# Altium project B100BA.PrjPcb (part 5 of 6)

## Sheet FOTA MicroController Block Diagram.SchDoc: FOTA MicroController Block Diagram
size 292 x 193 mm; SheetNumber: 29; SheetTotal: 50
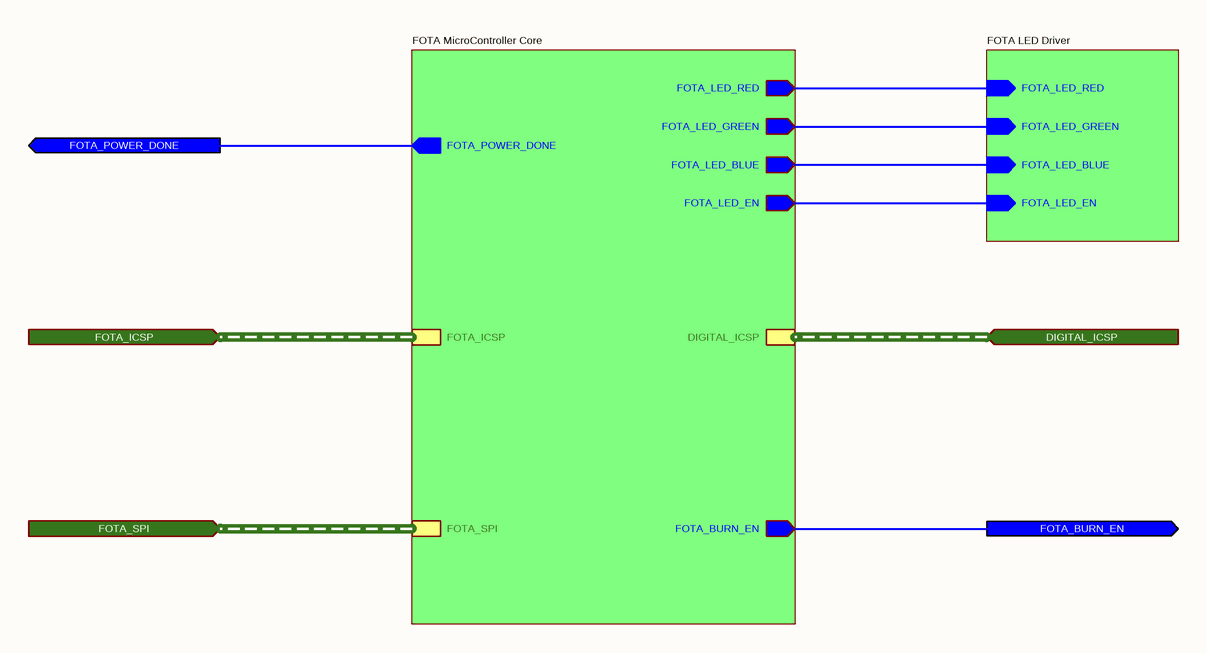
[diagram p32: FOTA MicroController Block Diagram.SchDoc]

### Sub-sheets
FOTA LED Driver = FOTA LED Driver.SchDoc: FOTA_LED_RED (in), FOTA_LED_EN (in), FOTA_LED_BLUE (in), FOTA_LED_GREEN (in)
FOTA MicroController Core = FOTA MicroController Core.SchDoc: FOTA_LED_BLUE (out), FOTA_LED_GREEN (out), FOTA_LED_EN (out), FOTA_POWER_DONE (out), FOTA_LED_RED (out), FOTA_BURN_EN (out), FOTA_SPI (harness FOTA_SPI), DIGITAL_ICSP (harness DIGITAL_ICSP), FOTA_ICSP (harness FOTA_ICSP)

### Ports
DIGITAL_ICSP (in, harness DIGITAL_ICSP), FOTA_BURN_EN (out), FOTA_ICSP (in, harness FOTA_ICSP), FOTA_POWER_DONE (out), FOTA_SPI (in, harness FOTA_SPI)

### Nets
FOTA_BURN_EN: port FOTA_BURN_EN, sheet FOTA MicroController Core/FOTA_BURN_EN
FOTA_LED_BLUE: sheet FOTA MicroController Core/FOTA_LED_BLUE, sheet FOTA LED Driver/FOTA_LED_BLUE
FOTA_LED_EN: sheet FOTA MicroController Core/FOTA_LED_EN, sheet FOTA LED Driver/FOTA_LED_EN
FOTA_LED_GREEN: sheet FOTA MicroController Core/FOTA_LED_GREEN, sheet FOTA LED Driver/FOTA_LED_GREEN
FOTA_LED_RED: sheet FOTA MicroController Core/FOTA_LED_RED, sheet FOTA LED Driver/FOTA_LED_RED
FOTA_POWER_DONE: port FOTA_POWER_DONE, sheet FOTA MicroController Core/FOTA_POWER_DONE

### Buses and harness runs
harness port DIGITAL_ICSP = sheet FOTA MicroController Core/DIGITAL_ICSP
harness port FOTA_ICSP = sheet FOTA MicroController Core/FOTA_ICSP
harness port FOTA_SPI = sheet FOTA MicroController Core/FOTA_SPI

### Notes on the sheet
- © 2021 All rights reserved.
  This document may not, in whole or in part, be copied, photocopied, reproduced, translated or converted to any electronic or machine readable from without prior written permission of Mehmet Günce Akkoyun.
  Engineer contact : akkoyun@me.com
- Property of
- Engineer :
- Date :
- Size :
- A4
- Time :
- Project :
- Page :
- /
- Customer :
- Product ID :
- Module ID :
- Version :
- File :
- Revision :

## Sheet FOTA MicroController Core.SchDoc: FOTA MicroController
size 292 x 193 mm; ApprovedBy: M. Günce Akkoyun; CheckedBy: M. Günce Akkoyun; Author: M. Günce Akkoyun; CompanyName: Ovoo Electronics; DrawnBy: M. Günce Akkoyun; Engineer: M. Günce Akkoyun; Organization: Ovoo Electronics; Address1: Necip Fazıl Mah. Ortaırmak Sok.; Address2: Birgül Apt. No: 19/6; Address3: Meram / Konya; Address4: Turkiye; DocumentNumber: 45; Revision: R01; SheetNumber: 30; SheetTotal: 42
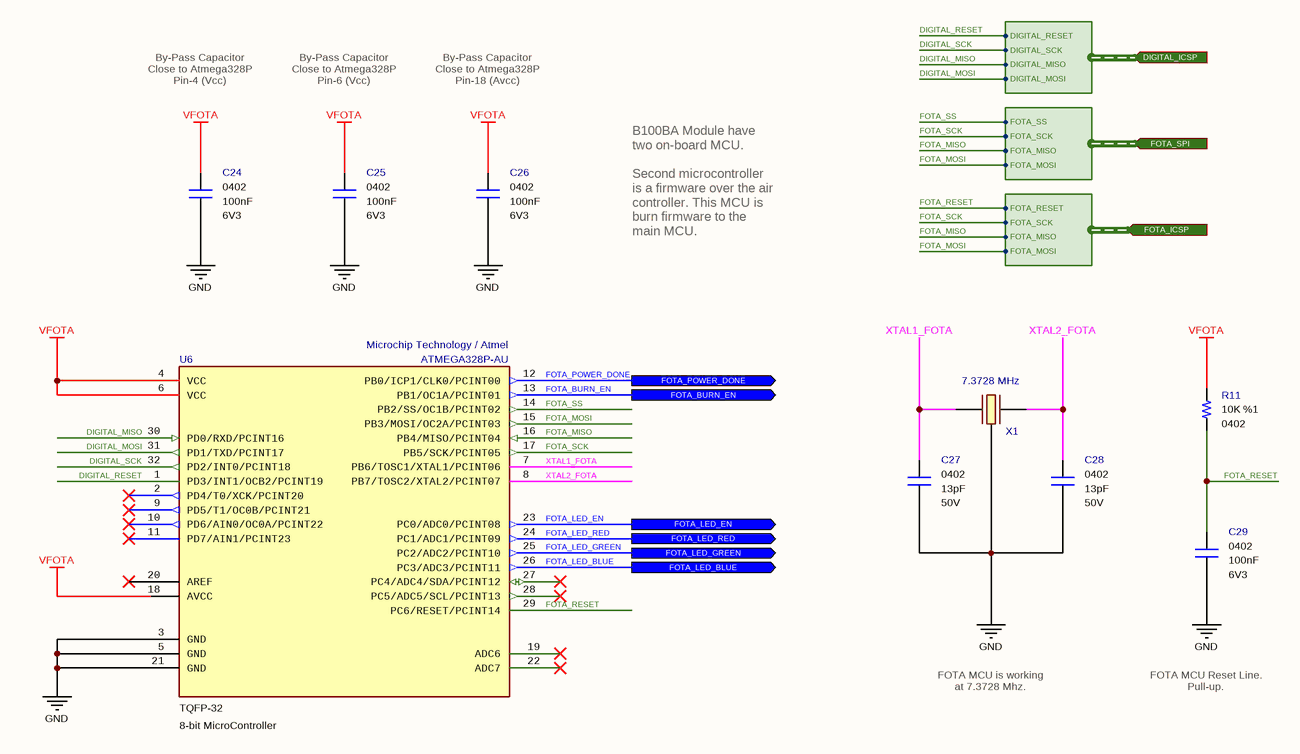
[diagram p33: FOTA MicroController Core.SchDoc]

### Parts
C24  value 100nF  Case: 0402  Voltage: 6V3  [CAPACITOR_0402]  (hidden comment: Multilayer Ceramic Capacitor)
C25  value 100nF  Case: 0402  Voltage: 6V3  [CAPACITOR_0402]  (hidden comment: Multilayer Ceramic Capacitor)
C26  value 100nF  Case: 0402  Voltage: 6V3  [CAPACITOR_0402]  (hidden comment: Multilayer Ceramic Capacitor)
C27  value 13pF  Voltage: 50V  Case: 0402  [CAPACITOR_0402]  (hidden comment: Multilayer Ceramic Capacitor)
C28  value 13pF  Voltage: 50V  Case: 0402  [CAPACITOR_0402]  (hidden comment: Multilayer Ceramic Capacitor)
C29  value 100nF  Case: 0402  Voltage: 6V3  [CAPACITOR_0402]  (hidden comment: Multilayer Ceramic Capacitor)
R11  value 10K  Tolerance: %1  Case: 0402  [RESISTOR_0402]  (hidden comment: Thick Film Resistor)
U6  8-bit MicroController  Case: TQFP-32  Manufacturer Part Number: ATMEGA328P-AU  Manufacturer Name: Microchip Technology / Atmel  [TQFP32]
X1  7.3728 MHz  [ABRACON_CRYSTAL]

### Ports
DIGITAL_ICSP (in, harness DIGITAL_ICSP), FOTA_BURN_EN (out), FOTA_ICSP (in, harness FOTA_ICSP), FOTA_LED_BLUE (out), FOTA_LED_EN (out), FOTA_LED_GREEN (out), FOTA_LED_RED (out), FOTA_POWER_DONE (out), FOTA_SPI (in, harness FOTA_SPI)

### Harnesses
FOTA_ICSP: FOTA_MOSI, FOTA_MISO, FOTA_SCK, FOTA_RESET
FOTA_SPI: FOTA_MOSI, FOTA_MISO, FOTA_SCK, FOTA_SS
DIGITAL_ICSP: DIGITAL_MOSI, DIGITAL_MISO, DIGITAL_SCK, DIGITAL_RESET

### Nets
GND: C24.1 C25.1 C26.1 C27.1 C28.1 C29.1 U6.3(GND) U6.5(GND) U6.21(GND) X1.2(GND)
VFOTA: C24.2 C25.2 C26.2 R11.2 U6.4(VCC) U6.6(VCC) U6.18(AVCC)
DIGITAL_MISO: U6.30(PD0/RXD/PCINT16) ; port DIGITAL_ICSP.DIGITAL_MISO  [project net DIGITAL_ICSP.DIGITAL_MISO]
DIGITAL_MOSI: U6.31(PD1/TXD/PCINT17) ; port DIGITAL_ICSP.DIGITAL_MOSI  [project net DIGITAL_ICSP.DIGITAL_MOSI]
DIGITAL_RESET: U6.1(PD3/INT1/OCB2/PCINT19) ; port DIGITAL_ICSP.DIGITAL_RESET  [project net DIGITAL_ICSP.DIGITAL_RESET]
DIGITAL_SCK: U6.32(PD2/INT0/PCINT18) ; port DIGITAL_ICSP.DIGITAL_SCK  [project net DIGITAL_ICSP.DIGITAL_SCK]
FOTA_BURN_EN: U6.13(PB1/OC1A/PCINT01) ; port FOTA_BURN_EN
FOTA_LED_BLUE: U6.26(PC3/ADC3/PCINT11) ; port FOTA_LED_BLUE
FOTA_LED_EN: U6.23(PC0/ADC0/PCINT08) ; port FOTA_LED_EN
FOTA_LED_GREEN: U6.25(PC2/ADC2/PCINT10) ; port FOTA_LED_GREEN
FOTA_LED_RED: U6.24(PC1/ADC1/PCINT09) ; port FOTA_LED_RED
FOTA_MISO: U6.16(PB4/MISO/PCINT04) ; port FOTA_ICSP.FOTA_MISO, port FOTA_SPI.FOTA_MISO  [project net FOTA_ICSP.FOTA_MISO]
FOTA_MOSI: U6.15(PB3/MOSI/OC2A/PCINT03) ; port FOTA_ICSP.FOTA_MOSI, port FOTA_SPI.FOTA_MOSI  [project net FOTA_ICSP.FOTA_MOSI]
FOTA_POWER_DONE: U6.12(PB0/ICP1/CLK0/PCINT00) ; port FOTA_POWER_DONE
FOTA_RESET: C29.2 R11.1 U6.29(PC6/RESET/PCINT14) ; port FOTA_ICSP.FOTA_RESET  [project net FOTA_ICSP.FOTA_RESET]
FOTA_SCK: U6.17(PB5/SCK/PCINT05) ; port FOTA_ICSP.FOTA_SCK, port FOTA_SPI.FOTA_SCK  [project net FOTA_ICSP.FOTA_SCK]
FOTA_SS: U6.14(PB2/SS/OC1B/PCINT02) ; port FOTA_SPI.FOTA_SS  [project net FOTA_SPI.FOTA_SS]
XTAL1_FOTA: C27.2 U6.7(PB6/TOSC1/XTAL1/PCINT06) X1.3(OUT/IN)
XTAL2_FOTA: C28.2 U6.8(PB7/TOSC2/XTAL2/PCINT07) X1.1(IN/OUT)

Not connected (* = marked no-connect by the designer): U6 2(PD4/T0/XCK/PCINT20)* 9(PD5/T1/OC0B/PCINT21)* 10(PD6/AIN0/OC0A/PCINT22)* 11(PD7/AIN1/PCINT23)* 19(ADC6)* 20(AREF)* 22(ADC7)* 27(PC4/ADC4/SDA/PCINT12)* 28(PC5/ADC5/SCL/PCINT13)*; X1 4(GND)

### Notes on the sheet
- By-Pass Capacitor
  Close to Atmega328P
  Pin-4 (Vcc)
- By-Pass Capacitor
  Close to Atmega328P
  Pin-6 (Vcc)
- By-Pass Capacitor
  Close to Atmega328P
  Pin-18 (Avcc)
- B100BA Module have two on-board MCU.
  Second microcontroller is a firmware over the air controller. This MCU is burn firmware to the main MCU.
- FOTA MCU is working at 7.3728 Mhz.
- FOTA MCU Reset Line. Pull-up.
- © 2021 All rights reserved.
  This document may not, in whole or in part, be copied, photocopied, reproduced, translated or converted to any electronic or machine readable from without prior written permission of Mehmet Günce Akkoyun.
  Engineer contact : akkoyun@me.com
- Property of
- Engineer :
- Date :
- Size :
- A4
- Time :
- Project :
- Page :
- /
- Customer :
- Product ID :
- Module ID :
- Version :
- File :
- Revision :

### Library data of the parts
C24-C26 C29 = Capacitor - 100nF [0402-6V3]: as C43 on sheet Master MicroController Core; Height: 0.25mm; ComponentLink1Description: Mouser; ComponentLink1URL: https://www.mouser.com.tr/ProductDetail/AVX/04026D104KAT4A?qs=sGAEpiMZZMs0AnBnWHyRQPg4iYkCw7IMED%2F4kpqgf7w%3D; ComponentLink2Description: DataSheet; ComponentLink2URL: https://www.mouser.com.tr/datasheet/2/40/cx5r-776519.pdf; ROHS: Yes; Maximum Operating Temperature: +85; Minimum Operating Temperature: -55; Supplier 1: Avnet; Supplier Part Number 1: 04026D104KAT4A; Mouser Part Number: 581-04026D104KAT4A
C27 C28 = Capacitor - 13pF [0402-50V]: Capacitor - 13pF [0402] (Ceramic); Manufacturer Name: Kemet; Manufacturer Part Number: CBR04C130F5GAC; Dielectric: C0G; Tolerance: 1%; Height: 0.55mm; ROHS: Yes; Weight: 0.65mg; ComponentLink1Description: DataSheet; ComponentLink1URL: http://www.kemet.com/Lists/ProductCatalog/Attachments/490/KEM_C1030_CBR_SMD.pdf; ComponentLink2Description: Mouser; ComponentLink2URL: http://www.mouser.com/Search/ProductDetail.aspx?qs=kSX8PZDGYstn%252bRHasf81FA%3d%3d; Supplier 1: Mouser; Supplier 2: Farnell; Supplier 3: Digi-Key; Supplier Part Number 3: 399-8812-1-ND; Supplier Part Number 2: 2773390; Supplier Part Number 1: 80-CBR04C130F5GAC; Mouser Part Number: 80-CBR04C130F5GAC
R11 = Resistor - 10K: as R21 on sheet Master MicroController Core; Height: 0.4mm; ComponentLink1Description: DataSheet; ComponentLink1URL: https://www.mouser.com.tr/datasheet/2/427/dcrcwe3-1762152.pdf; ComponentLink2Description: Mouser; ComponentLink2URL: https://www.mouser.com.tr/ProductDetail/Vishay-Dale/CRCW040210K0FKED?qs=sGAEpiMZZMu61qfTUdNhG2DpbjADlD3GcalbOv9utCY%3D; Supplier 1: Mouser; Supplier 2: Digi-Key; Supplier Part Number 1: 71-CRCW040210K0FKEDH; Supplier Part Number 2: 541-10.0KYCT-ND; Mouser Part Number: 71-CRCW0402-10K-E3
U6 = IC - ATMEGA328P: 8-bit Microcontrollers - MCU 32KB In-system Flash 20MHz 1.8V-5.5V; Supply Voltage - Min: 1.8V; Supply Voltage - Max: 5.5V; Height: 1mm; ComponentLink1Description: DataSheet; ComponentLink1URL: http://ww1.microchip.com/downloads/en/DeviceDoc/ATmega48A-PA-88A-PA-168A-PA-328-P-DS-DS40002061A.pdf; ROHS: Yes; Minimum Operating Temperature: -40; Maximum Operating Temperature: +85; ComponentLink2Description: Mouser; ComponentLink2URL: https://www.mouser.com.tr/ProductDetail/Microchip-Technology-Atmel/ATMEGA328P-AU?qs=sGAEpiMZZMtVoztFdqDXO3RbBx7FKCmV; ComponentLink3Description: ProductPage; ComponentLink3URL: https://www.microchip.com/wwwproducts/en/ATmega328p; Supplier 1: Avnet; Supplier 2: Mouser; Supplier 3: Arrow; Supplier 4: Digi-Key; Supplier Part Number 1: ATMEGA328P-AU; Supplier Part Number 2: 556-ATMEGA328P-AU; Supplier Part Number 3: ATMEGA328P-AU; Supplier Part Number 4: ATMEGA328P-AU-ND; Mouser Part Number: 556-ATMEGA328P-AU
X1 = Crystal - 7.3728 MHz (Abracon): Crystals 7.3728MHz 18pF -40C +85C; Manufacturer Part Number: ABMM2-7.3728MHZ-E2-T; ESR: 150 Ohms; Frequency Stability: 20 ppm; Height: 1.2 mm; Frequency: 7.3728 MHz; Maximum Operating Temperature: +70; Minimum Operating Temperature: -20; ROHS: Yes; Tolerance: 20 ppm; ComponentLink1Description: DataSheet; ComponentLink1URL: https://www.ecsxtal.com/store/pdf/csm-8mr.pdf; ComponentLink2Description: Mouser; ComponentLink2URL: https://www.mouser.com/Search/Refine.aspx?Keyword=520-7.3-18-20BM-JENT; Supplier 1: Mouser; Supplier 2: Arrow; Supplier Part Number 2: ABMM2-7.3728MHZ-E2-T; Supplier Part Number 1: 815-ABMM2-7.3-E2-T; Manufacturer Name: ABRACON; Mouser Part Number: 815-ABMM2-7.3-E2-T; Case: SMD

## Sheet FOTA LED Driver.SchDoc: FOTA MicroController LED Inducators
size 393 x 281 mm; ApprovedBy: M. Günce Akkoyun; CheckedBy: M. Günce Akkoyun; Author: M. Günce Akkoyun; CompanyName: Ovoo Electronics; DrawnBy: M. Günce Akkoyun; Engineer: M. Günce Akkoyun; Organization: Ovoo Electronics; Address1: Necip Fazıl Mah. Ortaırmak Sok.; Address2: Birgül Apt. No: 19/6; Address3: Meram / Konya; Address4: Turkiye; DocumentNumber: 12; Revision: R01; SheetNumber: 31; SheetTotal: 44
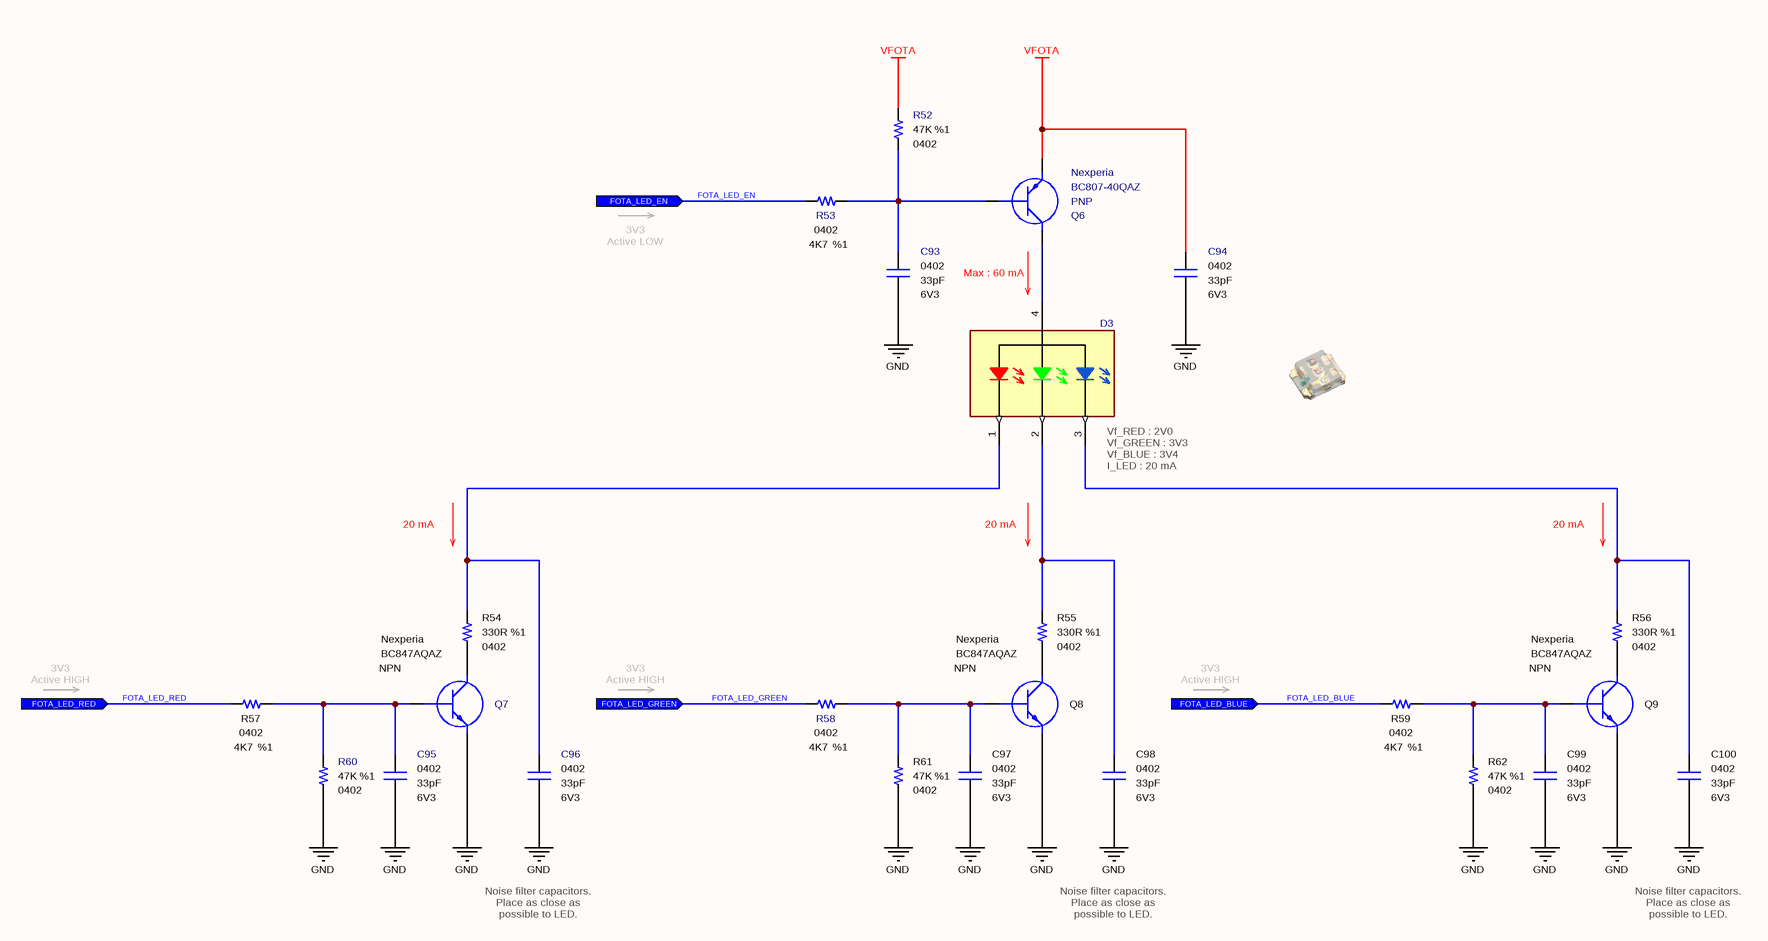
[diagram p34: FOTA LED Driver.SchDoc]

### Parts
C93  value 33pF  Case: 0402  Voltage: 6V3  [CAPACITOR_0402]  (hidden comment: Multilayer Ceramic Capacitor)
C94  value 33pF  Case: 0402  Voltage: 6V3  [CAPACITOR_0402]  (hidden comment: Multilayer Ceramic Capacitor)
C95  value 33pF  Case: 0402  Voltage: 6V3  [CAPACITOR_0402]  (hidden comment: Multilayer Ceramic Capacitor)
C96  value 33pF  Case: 0402  Voltage: 6V3  [CAPACITOR_0402]  (hidden comment: Multilayer Ceramic Capacitor)
C97  value 33pF  Case: 0402  Voltage: 6V3  [CAPACITOR_0402]  (hidden comment: Multilayer Ceramic Capacitor)
C98  value 33pF  Case: 0402  Voltage: 6V3  [CAPACITOR_0402]  (hidden comment: Multilayer Ceramic Capacitor)
C99  value 33pF  Case: 0402  Voltage: 6V3  [CAPACITOR_0402]  (hidden comment: Multilayer Ceramic Capacitor)
C100  value 33pF  Case: 0402  Voltage: 6V3  [CAPACITOR_0402]  (hidden comment: Multilayer Ceramic Capacitor)
D3  150066M153000  [Wurth_0606]  (value not drawn)
Q6  Polarity: PNP  Manufacturer Name: Nexperia  Manufacturer Part Number: BC807-40QAZ  [SOT1215]  (hidden comment: Bipolar PNP Transistors)
Q7  Polarity: NPN  Manufacturer Name: Nexperia  [SOT1215]  (hidden comment: BC847AQAZ)
Q8  Polarity: NPN  Manufacturer Name: Nexperia  [SOT1215]  (hidden comment: BC847AQAZ)
Q9  Polarity: NPN  Manufacturer Name: Nexperia  [SOT1215]  (hidden comment: BC847AQAZ)
R52  value 47K  Tolerance: %1  Case: 0402  [RESISTOR_0402]  (hidden comment: 47K - 0402 - %1 - 1/16W)
R53  value 4K7  Tolerance: %1  Case: 0402  [RESISTOR_0402]  (hidden comment: Thick Film Resistor)
R54  value 330R  Case: 0402  Tolerance: %1  [RESISTOR_0402]  (hidden comment: 330R - 0402 - %1 - 1/16W)
R55  value 330R  Case: 0402  Tolerance: %1  [RESISTOR_0402]  (hidden comment: 330R - 0402 - %1 - 1/16W)
R56  value 330R  Case: 0402  Tolerance: %1  [RESISTOR_0402]  (hidden comment: 330R - 0402 - %1 - 1/16W)
R57  value 4K7  Tolerance: %1  Case: 0402  [RESISTOR_0402]  (hidden comment: Thick Film Resistor)
R58  value 4K7  Tolerance: %1  Case: 0402  [RESISTOR_0402]  (hidden comment: Thick Film Resistor)
R59  value 4K7  Tolerance: %1  Case: 0402  [RESISTOR_0402]  (hidden comment: Thick Film Resistor)
R60  value 47K  Tolerance: %1  Case: 0402  [RESISTOR_0402]  (hidden comment: 47K - 0402 - %1 - 1/16W)
R61  value 47K  Tolerance: %1  Case: 0402  [RESISTOR_0402]  (hidden comment: 47K - 0402 - %1 - 1/16W)
R62  value 47K  Tolerance: %1  Case: 0402  [RESISTOR_0402]  (hidden comment: 47K - 0402 - %1 - 1/16W)

### Ports
FOTA_LED_BLUE (in), FOTA_LED_EN (in), FOTA_LED_GREEN (in), FOTA_LED_RED (in)

### Nets
GND: C93.2 C94.2 C95.2 C96.2 C97.2 C98.2 C99.2 C100.2 Q7.2(E) Q8.2(E) Q9.2(E) R60.1 R61.1 R62.1
VFOTA: C94.1 Q6.2(E) R52.2
FOTA_LED_BLUE: R59.2 ; port FOTA_LED_BLUE
FOTA_LED_EN: R53.2 ; port FOTA_LED_EN
FOTA_LED_GREEN: R58.2 ; port FOTA_LED_GREEN
FOTA_LED_RED: R57.2 ; port FOTA_LED_RED
NetC93_1: C93.1 Q6.1(B) R52.1 R53.1
NetC95_1: C95.1 Q7.1(B) R57.1 R60.2
NetC96_1: C96.1 D3.1 R54.2
NetC97_1: C97.1 Q8.1(B) R58.1 R61.2
NetC98_1: C98.1 D3.2 R55.2
NetC99_1: C99.1 Q9.1(B) R59.1 R62.2
NetC100_1: C100.1 D3.3 R56.2
NetD3_4: D3.4 Q6.3(C)
NetQ7_3: Q7.3(C) R54.1
NetQ8_3: Q8.3(C) R55.1
NetQ9_3: Q9.3(C) R56.1

### Notes on the sheet
- 3V3
  Active LOW
- Max : 60 mA
- (near D3) Vf_RED : 2V0
  Vf_GREEN : 3V3
  Vf_BLUE : 3V4
  I_LED : 20 mA
- 20 mA
- 3V3
  Active HIGH
- Noise filter capacitors. Place as close as possible to LED.
- © 2021 All rights reserved.
  This document may not, in whole or in part, be copied, photocopied, reproduced, translated or converted to any electronic or machine readable from without prior written permission of Mehmet Günce Akkoyun.
  Engineer contact : akkoyun@me.com
- Property of
- Engineer :
- Date :
- Size :
- A3
- Time :
- Project :
- Page :
- /
- Customer :
- Product ID :
- Module ID :
- Version :
- File :
- Revision :

### Library data of the parts
C93-C100 = Capacitor - 33pF [0402-6V3]: as C126-C133 on sheet Master MicroController Port C; Height: 0.5mm; Maximum Operating Temperature: +125; Minimum Operating Temperature: -55; ROHS: Yes; ComponentLink1Description: DataSheet; ComponentLink1URL: https://api.kemet.com/component-edge/download/datasheet/C0402C330J9RACAUTO.pdf; ComponentLink2Description: Mouser; ComponentLink2URL: https://www.mouser.com/Search/Refine.aspx?Keyword=80-C0402C330J9RAUTO; Supplier 1: Mouser; Supplier Part Number 1: 80-C0402C330J9RAUTO; Mouser Part Number: 80-C0402C330J9RAUTO
D3 = Diode - RGB LED (150066M153000): Standard LEDs - SMD PICOLED series Red LED; Manufacturer Name: Wurth Elektronik; Datasheet Link: https://www.mouser.com.tr/datasheet/2/445/150066M153000-1715259.pdf; Manufacturer Part Number: 150066M153000; Mouser Part Number: 710-150066M153000; Mouser Price/Stock: https://www.mouser.com.tr/ProductDetail/ROHM-Semiconductor/SML-P12U2TT86R?qs=sGAEpiMZZMseGfSY3csMkRIBDsfU3UCXJTULB5gem9Ta%252Bp%252BvZ709fg%3D%3D; Case: 0606; ROHS: Yes; Supplier 1: RSComponents; Supplier 2: RSComponents; Supplier 3: Mouser; Supplier 4: Farnell; Supplier 5: Digi-Key; Supplier 6: Digi-Key; Supplier 7: Digi-Key; Supplier 8: Newark; Supplier Part Number 1: 1765006; Supplier Part Number 2: 1766050; Supplier Part Number 3: 710-150066M153000; Supplier Part Number 4: 2764964; Supplier Part Number 5: 732-11390-1-ND; Supplier Part Number 6: 732-11390-6-ND; Supplier Part Number 7: 732-11390-2-ND; Supplier Part Number 8: 22AC3253
Q6 = Transistor - BC807: Bipolar Transistors - BJT 45 V, 500 mA PNP gen purpose transistors; Mouser Part Number: 771-BC807-40QAZ; ComponentLink1Description: DataSheet; ComponentLink1URL: https://www.mouser.com.tr/datasheet/2/916/BC807-25QA_40QA-1665956.pdf; ComponentLink2Description: Mouser; ComponentLink2URL: https://www.mouser.com.tr/ProductDetail/Nexperia/BC807-40QAZ?qs=sGAEpiMZZMshyDBzk1%2FWi8mfWMj7sMzapbI3Mu1S6AqR9y7krhZTdA%3D%3D; Supplier 1: Mouser; Supplier 2: Arrow; Supplier 3: Digi-Key; Supplier 4: Digi-Key; Supplier Part Number 1: 771-BC807-40QAZ; Supplier Part Number 2: BC807-40QAZ; Supplier Part Number 3: 1727-2242-1-ND; Supplier Part Number 4: 1727-2242-6-ND; Case: DFN-1010D-3
Q7-Q9 = Transistor - BC847: Bipolar NPN Transistors; Case: DFN-1010D-3; Supplier 1: Digi-Key; Supplier 2: Digi-Key; Supplier Part Number 1: 1727-2545-1-ND; Supplier Part Number 2: 1727-2545-6-ND; Manufacturer Part Number: BC847AQAZ; Supplier 3: Avnet; Supplier 4: Arrow Electronics; Supplier 5: Mouser; Supplier 6: Newark; Supplier 7: Digi-Key; Supplier 8: Farnell; Supplier 9: Farnell; Supplier Part Number 3: BC847AQAZ; Supplier Part Number 4: BC847AQAZ; Supplier Part Number 5: 771-BC847AQAZ; Supplier Part Number 6: 82Y6125; Supplier Part Number 7: 1727-2545-2-ND; Supplier Part Number 8: 2545344; Supplier Part Number 9: 2545344RL
R52 R60-R62 = Resistor - 47K: as R16 on sheet SD Card; Height: 0.4mm; ComponentLink1Description: DataSheet; ComponentLink1URL: https://www.mouser.com.tr/datasheet/2/427/dcrcwe3-1762152.pdf; ComponentLink2Description: Mouser; ComponentLink2URL: https://www.mouser.com.tr/ProductDetail/Vishay-Dale/CRCW040247K0FKED?qs=sGAEpiMZZMu61qfTUdNhG2DpbjADlD3GL%252B3h1elTxqU%3D; Supplier 1: RSComponents; Supplier 2: Newark; Supplier Part Number 1: 6789361P; Supplier Part Number 2: 52K7097; Supplier 3: Avnet; Supplier 4: RSComponents; Supplier 5: Future Electronics; Supplier 6: Future Electronics; Supplier 7: Newark; Supplier 8: Arrow Electronics; Supplier 9: Mouser; Supplier 10: Newark; Supplier 11: Avnet; Supplier 12: Digi-Key; Supplier 13: Digi-Key; Supplier 14: Digi-Key; Supplier 15: Newark; Supplier 16: Farnell; Supplier 17: Farnell; Supplier 18: Farnell; Supplier 19: Allied Electronics; Supplier 20: Allied Electronics; Supplier 21: Avnet; Supplier 22: Future Electronics; Supplier 23: Future Electronics; Supplier 24: Future Electronics; Supplier 25: Newark; Supplier 26: RSComponents; Supplier 27: RSComponents; Supplier Part Number 3: 52K7097; Supplier Part Number 4: 6789361; Supplier Part Number 5: 2103738; Supplier Part Number 6: 7521222; Supplier Part Number 7: 42K3500; Supplier Part Number 8: CRCW040247K0FKED; Supplier Part Number 12: 541-47.0KLCT-ND; Supplier Part Number 14: 541-47.0KLTR-ND; Supplier Part Number 10: 61M5310; Supplier Part Number 9: 71-CRCW0402-47K-E3; Supplier Part Number 13: 541-47.0KLDKR-ND; Supplier Part Number 11: CRCW040247K0FKED; Supplier Part Number 15: 25AC7165; Supplier Part Number 16: 1469719; Supplier Part Number 18: 2121814; Supplier Part Number 17: 1469719RL; Supplier Part Number 19: 70202660; Supplier Part Number 20: 70272767; Supplier Part Number 21: 42K3500; Supplier Part Number 22: 6128776; Supplier Part Number 24: CRCW040247K0FKED-REEL; Supplier Part Number 23: CRCW040247K0FKED-CUTT; Supplier Part Number 25: 24W2315; Supplier Part Number 26: 1688455; Supplier Part Number 27: 1823505
R53 R57-R59 = Resistor - 4K7: Thick Film Resistors - SMD 1/16 W 4.7 Kohms 1%; Manufacturer Name: Vishay; Manufacturer Part Number: CRCW04024K70FKED; Height: 0.4mm; Mouser Part Number: 71-CRCW0402-4.7K-E3; ComponentLink1Description: DataSheet; ComponentLink1URL: https://www.mouser.com.tr/datasheet/2/427/dcrcwe3-1762152.pdf; ComponentLink2Description: Mouser; ComponentLink2URL: https://www.mouser.com.tr/ProductDetail/Vishay-Dale/CRCW04024K70FKED?qs=sGAEpiMZZMu61qfTUdNhG7nHf%2F6MTUn3HadIdDQu24Q%3D; Supplier 1: Mouser; Supplier 2: Digi-Key; Supplier Part Number 2: 541-4.70KLCT-ND; Supplier Part Number 1: 71-CRCW0402-4.7K-E3
R54-R56 = Resistor - 330R: as R24-R26 on sheet Master MicroController LED; Height: 0.4mm; Mouser Part Number: 71-CRCW0402-330-E3; ComponentLink1Description: DataSheet; ComponentLink1URL: https://www.mouser.com.tr/datasheet/2/427/dcrcwe3-1762152.pdf; ComponentLink2Description: Mouser; ComponentLink2URL: https://www.mouser.com.tr/ProductDetail/Vishay-Dale/CRCW0402330RFKED?qs=sGAEpiMZZMu61qfTUdNhG2DpbjADlD3GGS6SwBlLi5Q%3D; Supplier 1: Digi-Key; Supplier 2: Digi-Key; Supplier 3: Digi-Key; Supplier 4: Newark; Supplier 5: Newark; Supplier 6: RSComponents; Supplier 7: RSComponents; Supplier 8: Future Electronics; Supplier 9: Future Electronics; Supplier 10: Newark; Supplier 11: Newark; Supplier 12: Arrow Electronics; Supplier 13: Mouser; Supplier 14: Avnet; Supplier 15: Farnell; Supplier 16: Farnell; Supplier 17: Farnell; Supplier 18: Allied Electronics; Supplier 19: Allied Electronics; Supplier 20: Avnet; Supplier 21: Avnet; Supplier 22: Future Electronics; Supplier 23: Future Electronics; Supplier 24: Newark; Supplier 25: RSComponents; Supplier 26: RSComponents; Supplier Part Number 1: 541-330LCT-ND; Supplier Part Number 2: 541-330LDKR-ND; Supplier Part Number 3: 541-330LTR-ND; Supplier Part Number 4: 52K6981; Supplier Part Number 5: 61M5301; Supplier Part Number 6: 6789178P; Supplier Part Number 7: 6789178; Supplier Part Number 9: 9848185; Supplier Part Number 8: 4103726; Supplier Part Number 10: 25AC7117; Supplier Part Number 11: 42K3473; Supplier Part Number 26: 1819488; Supplier Part Number 25: 1688408; Supplier Part Number 24: 24W2220; Supplier Part Number 23: CRCW0402330RFKED-REEL; Supplier Part Number 22: CRCW0402330RFKED-CUTT; Supplier Part Number 21: 52K6981; Supplier Part Number 20: 42K3473; Supplier Part Number 19: 70272759; Supplier Part Number 18: 70202255; Supplier Part Number 17: 1469709RL; Supplier Part Number 16: 2121540; Supplier Part Number 15: 1469709; Supplier Part Number 14: CRCW0402330RFKED; Supplier Part Number 13: 71-CRCW0402-330-E3; Supplier Part Number 12: CRCW0402330RFKED

## Sheet FOTA MicroController Power Switch.SchDoc: FOTA MicroController Latched Power Trigger
size 292 x 193 mm; ApprovedBy: M. Günce Akkoyun; CheckedBy: M. Günce Akkoyun; Author: M. Günce Akkoyun; CompanyName: Ovoo Electronics; DrawnBy: M. Günce Akkoyun; Engineer: M. Günce Akkoyun; Organization: Ovoo Electronics; Address1: Necip Fazıl Mah. Ortaırmak Sok.; Address2: Birgül Apt. No: 19/6; Address3: Meram / Konya; Address4: Turkiye; DocumentNumber: 44; Revision: R01; SheetNumber: 32; SheetTotal: 42
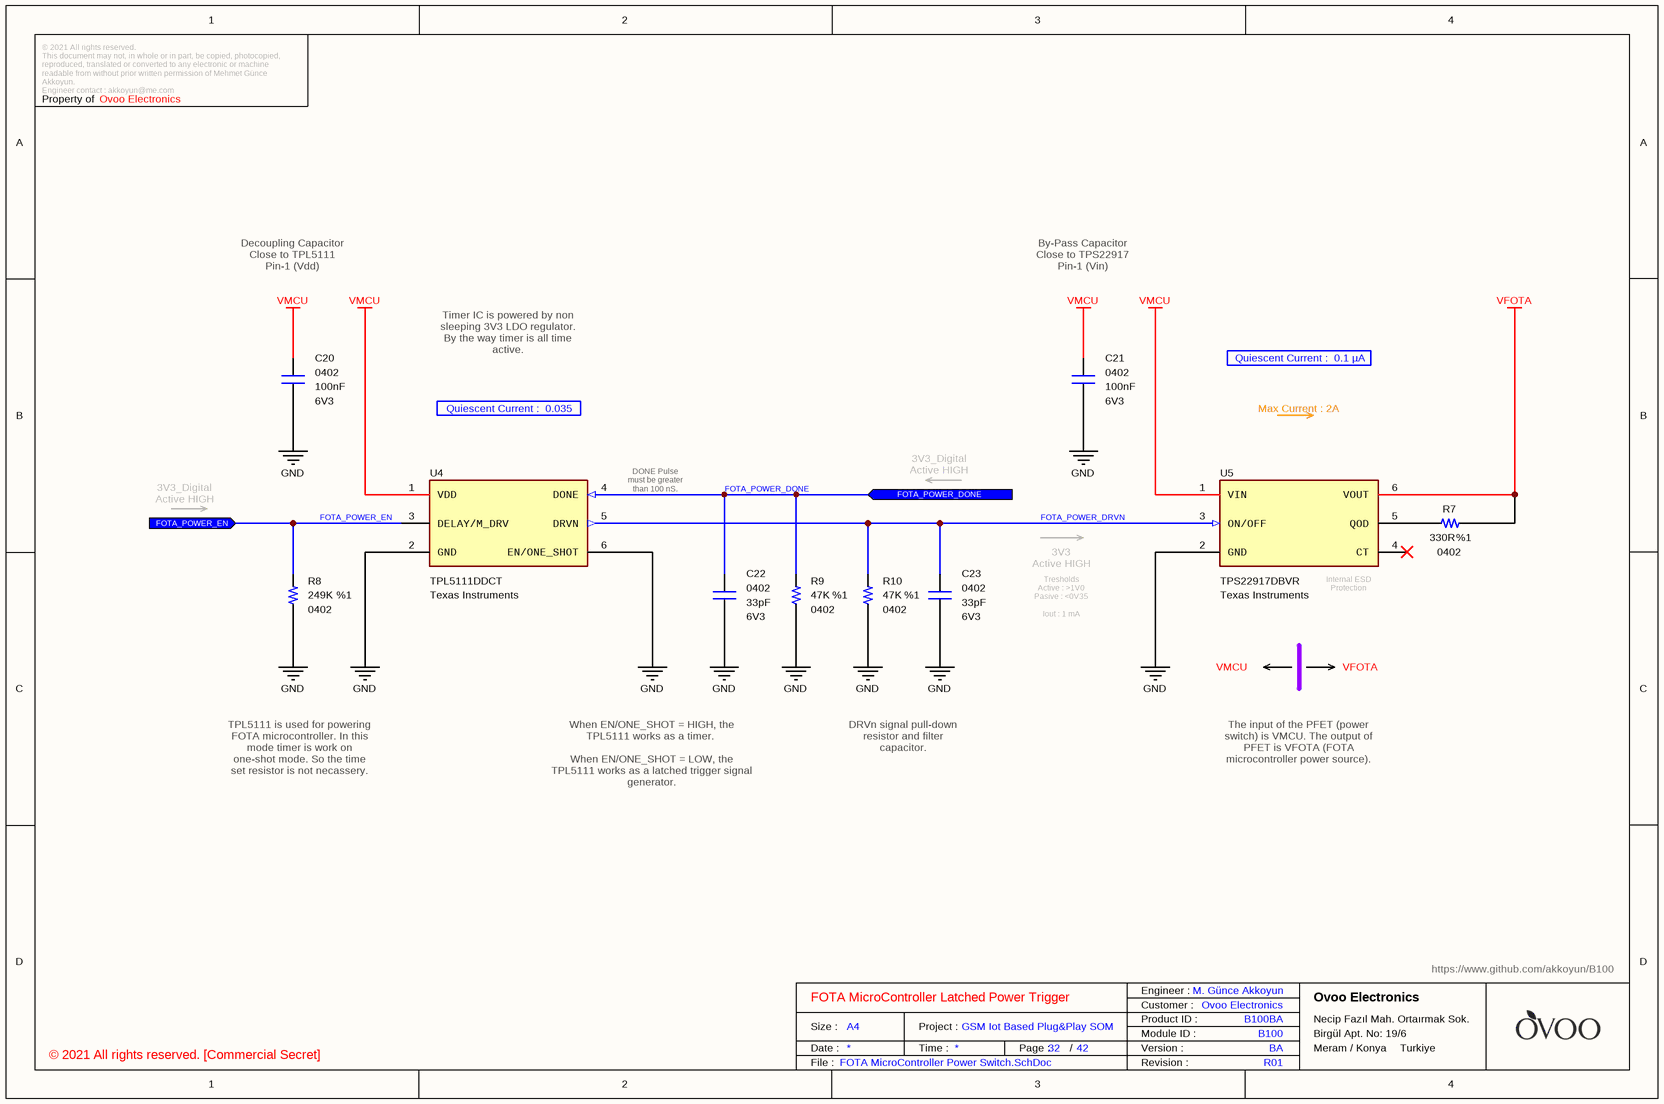
[diagram p35: FOTA MicroController Power Switch.SchDoc]

### Parts
C20  value 100nF  Case: 0402  Voltage: 6V3  [CAPACITOR_0402]  (hidden comment: Multilayer Ceramic Capacitor)
C21  value 100nF  Case: 0402  Voltage: 6V3  [CAPACITOR_0402]  (hidden comment: Multilayer Ceramic Capacitor)
C22  value 33pF  Case: 0402  Voltage: 6V3  [CAPACITOR_0402]  (hidden comment: Multilayer Ceramic Capacitor)
C23  value 33pF  Case: 0402  Voltage: 6V3  [CAPACITOR_0402]  (hidden comment: Multilayer Ceramic Capacitor)
R7  value 330R  Tolerance: %1  Case: 0402  [RESISTOR_0402]  (hidden comment: 330R - 0402 - %1 - 1/16W)
R8  value 249K  Tolerance: %1  Case: 0402  [RESISTOR_0402]  (hidden comment: Thick Film Resistor)
R9  value 47K  Tolerance: %1  Case: 0402  [RESISTOR_0402]  (hidden comment: 47K - 0402 - %1 - 1/16W)
R10  value 47K  Tolerance: %1  Case: 0402  [RESISTOR_0402]  (hidden comment: 47K - 0402 - %1 - 1/16W)
U4  Manufacturer Part Number: TPL5111DDCT  Manufacturer Name: Texas Instruments  [SOT-23-6]  (hidden comment: Nanopower Timer IC)
U5  Manufacturer Part Number: TPS22917DBVR  Manufacturer Name: Texas Instruments  [SOT-23-6]  (hidden comment: Power Switch)

### Ports
FOTA_POWER_DONE (in), FOTA_POWER_EN (in)

### Nets
GND: C20.1 C21.2 C22.1 C23.1 R8.1 R9.1 R10.1 U4.2(GND) U4.6(EN/ONE_SHOT) U5.2(GND)
VFOTA: R7.1 U5.6(VOUT)
VMCU: C20.2 C21.1 U4.1(VDD) U5.1(VIN)
FOTA_POWER_DONE: C22.2 R9.2 U4.4(DONE) ; port FOTA_POWER_DONE
FOTA_POWER_DRVN: C23.2 R10.2 U4.5(DRVN) U5.3(ON/OFF)
FOTA_POWER_EN: R8.2 U4.3(DELAY/M_DRV) ; port FOTA_POWER_EN
NetR7_2: R7.2 U5.5(QOD)

Not connected (* = marked no-connect by the designer): U5 4(CT)*

### Notes on the sheet
- Decoupling Capacitor
  Close to TPL5111
  Pin-1 (Vdd)
- By-Pass Capacitor
  Close to TPS22917
  Pin-1 (Vin)
- Quiescent Current :  0.035 µA
- Timer IC is powered by non sleeping 3V3 LDO regulator. By the way timer is all time active.
- Quiescent Current :  0.1 µA
- 3V3_Digital
  Active HIGH
- Max Current : 2A
- (near U4) DONE Pulse must be greater than 100 nS.
- Tresholds
  Active : >1V0
  Pasive : <0V35
  Iout : 1 mA
- 3V3
  Active HIGH
- (near U5) Internal ESD Protection
- VMCU
- VFOTA
- DRVn signal pull-down resistor and filter capacitor.
- TPL5111 is used for powering FOTA microcontroller. In this mode timer is work on one-shot mode. So the time set resistor is not necassery.
- When EN/ONE_SHOT = HIGH, the TPL5111 works as a timer.
  When EN/ONE_SHOT = LOW, the TPL5111 works as a latched trigger signal generator.
- The input of the PFET (power switch) is VMCU. The output of PFET is VFOTA (FOTA microcontroller power source).
- © 2021 All rights reserved.
  This document may not, in whole or in part, be copied, photocopied, reproduced, translated or converted to any electronic or machine readable from without prior written permission of Mehmet Günce Akkoyun.
  Engineer contact : akkoyun@me.com
- Property of
- Engineer :
- Date :
- Size :
- A4
- Time :
- Project :
- Page :
- /
- Customer :
- Product ID :
- Module ID :
- Version :
- File :
- Revision :

### Library data of the parts
C20 C21 = Capacitor - 100nF [0402-6V3]: Capacitor - 100nF [0402-6V3] (Ceramic); Manufacturer Name: AVX; Manufacturer Part Number: 04026D104KAT4A; Dielectric: X5R; Tolerance: %10; Height: 0.25mm; ComponentLink1Description: Mouser; ComponentLink1URL: https://www.mouser.com.tr/ProductDetail/AVX/04026D104KAT4A?qs=sGAEpiMZZMs0AnBnWHyRQPg4iYkCw7IMED%2F4kpqgf7w%3D; ComponentLink2Description: DataSheet; ComponentLink2URL: https://www.mouser.com.tr/datasheet/2/40/cx5r-776519.pdf; ROHS: Yes; Maximum Operating Temperature: +85; Minimum Operating Temperature: -55; Supplier 1: Avnet; Supplier Part Number 1: 04026D104KAT4A; Mouser Part Number: 581-04026D104KAT4A
C22 C23 = Capacitor - 33pF [0402-6V3]: Capacitor - 33pF [0402] (Ceramic); Manufacturer Name: Kemet; Manufacturer Part Number: C0402C330J9RACAUTO; Dielectric: X7R; Tolerance: 10%; Height: 0.5mm; Maximum Operating Temperature: +125; Minimum Operating Temperature: -55; ROHS: Yes; ComponentLink1Description: DataSheet; ComponentLink1URL: https://api.kemet.com/component-edge/download/datasheet/C0402C330J9RACAUTO.pdf; ComponentLink2Description: Mouser; ComponentLink2URL: https://www.mouser.com/Search/Refine.aspx?Keyword=80-C0402C330J9RAUTO; Supplier 1: Mouser; Supplier Part Number 1: 80-C0402C330J9RAUTO; Mouser Part Number: 80-C0402C330J9RAUTO
R7 = Resistor - 330R: Thick Film Resistors - SMD 1/16 W 330 Ohm 1%; Manufacturer Name: Vishay; Manufacturer Part Number: CRCW0402330RFKED; Height: 0.4mm; ComponentLink1Description: DataSheet; ComponentLink1URL: https://www.mouser.com.tr/datasheet/2/427/dcrcwe3-1762152.pdf; ComponentLink2Description: Mouser; ComponentLink2URL: https://www.mouser.com.tr/ProductDetail/Vishay-Dale/CRCW0402330RFKED?qs=sGAEpiMZZMu61qfTUdNhG2DpbjADlD3GGS6SwBlLi5Q%3D; Supplier 1: Digi-Key; Supplier 2: Digi-Key; Supplier Part Number 2: 541-330LDKR-ND; Supplier Part Number 1: 541-330LCT-ND; Mouser Part Number: 71-CRCW0402-330-E3; Supplier 3: Digi-Key; Supplier 4: Newark; Supplier 5: Newark; Supplier 6: RSComponents; Supplier 7: RSComponents; Supplier 8: Future Electronics; Supplier 9: Future Electronics; Supplier 10: Newark; Supplier 11: Newark; Supplier 12: Arrow Electronics; Supplier 13: Mouser; Supplier 14: Avnet; Supplier 15: Farnell; Supplier 16: Farnell; Supplier 17: Farnell; Supplier 18: Allied Electronics; Supplier 19: Allied Electronics; Supplier 20: Avnet; Supplier 21: Avnet; Supplier 22: Future Electronics; Supplier 23: Future Electronics; Supplier 24: Newark; Supplier 25: RSComponents; Supplier 26: RSComponents; Supplier Part Number 3: 541-330LTR-ND; Supplier Part Number 4: 52K6981; Supplier Part Number 5: 61M5301; Supplier Part Number 6: 6789178P; Supplier Part Number 7: 6789178; Supplier Part Number 9: 9848185; Supplier Part Number 8: 4103726; Supplier Part Number 10: 25AC7117; Supplier Part Number 11: 42K3473; Supplier Part Number 26: 1819488; Supplier Part Number 25: 1688408; Supplier Part Number 24: 24W2220; Supplier Part Number 23: CRCW0402330RFKED-REEL; Supplier Part Number 22: CRCW0402330RFKED-CUTT; Supplier Part Number 21: 52K6981; Supplier Part Number 20: 42K3473; Supplier Part Number 19: 70272759; Supplier Part Number 18: 70202255; Supplier Part Number 17: 1469709RL; Supplier Part Number 16: 2121540; Supplier Part Number 15: 1469709; Supplier Part Number 14: CRCW0402330RFKED; Supplier Part Number 13: 71-CRCW0402-330-E3; Supplier Part Number 12: CRCW0402330RFKED
R8 = Resistor - 249K: Thick Film Resistors - SMD 1/16 W 249 Kohms 1%; Manufacturer Name: Vishay; Manufacturer Part Number: CRCW0402249KFKED; Height: 0.35mm; ComponentLink1Description: DataSheet; ComponentLink1URL: https://www.mouser.com.tr/datasheet/2/427/dcrcwe3-1762152.pdf; ComponentLink2Description: Mouser; ComponentLink2URL: https://www.mouser.com.tr/ProductDetail/Vishay-Dale/CRCW0402249KFKED?qs=sGAEpiMZZMu61qfTUdNhG2DpbjADlD3GEiYBObatoAI%3D; Supplier 1: Mouser; Supplier 2: Digi-Key; Supplier Part Number 1: 71-CRCW0402-249K-E3; Supplier Part Number 2: 541-249KLCT-ND; Mouser Part Number: 71-CRCW0402-249K-E3
R9 R10 = Resistor - 47K: Thick Film Resistors - SMD 1/16 W 47 Kohms 1%; Manufacturer Name: Vishay; Manufacturer Part Number: CRCW040247K0FKED; Height: 0.4mm; ComponentLink1Description: DataSheet; ComponentLink1URL: https://www.mouser.com.tr/datasheet/2/427/dcrcwe3-1762152.pdf; ComponentLink2Description: Mouser; ComponentLink2URL: https://www.mouser.com.tr/ProductDetail/Vishay-Dale/CRCW040247K0FKED?qs=sGAEpiMZZMu61qfTUdNhG2DpbjADlD3GL%252B3h1elTxqU%3D; Supplier 1: RSComponents; Supplier 2: Newark; Supplier Part Number 1: 6789361P; Supplier Part Number 2: 52K7097; Supplier 3: Avnet; Supplier 4: RSComponents; Supplier 5: Future Electronics; Supplier 6: Future Electronics; Supplier 7: Newark; Supplier 8: Arrow Electronics; Supplier 9: Mouser; Supplier 10: Newark; Supplier 11: Avnet; Supplier 12: Digi-Key; Supplier 13: Digi-Key; Supplier 14: Digi-Key; Supplier 15: Newark; Supplier 16: Farnell; Supplier 17: Farnell; Supplier 18: Farnell; Supplier 19: Allied Electronics; Supplier 20: Allied Electronics; Supplier 21: Avnet; Supplier 22: Future Electronics; Supplier 23: Future Electronics; Supplier 24: Future Electronics; Supplier 25: Newark; Supplier 26: RSComponents; Supplier 27: RSComponents; Supplier Part Number 3: 52K7097; Supplier Part Number 4: 6789361; Supplier Part Number 5: 2103738; Supplier Part Number 6: 7521222; Supplier Part Number 7: 42K3500; Supplier Part Number 8: CRCW040247K0FKED; Supplier Part Number 12: 541-47.0KLCT-ND; Supplier Part Number 14: 541-47.0KLTR-ND; Supplier Part Number 10: 61M5310; Supplier Part Number 9: 71-CRCW0402-47K-E3; Supplier Part Number 13: 541-47.0KLDKR-ND; Supplier Part Number 11: CRCW040247K0FKED; Supplier Part Number 15: 25AC7165; Supplier Part Number 16: 1469719; Supplier Part Number 18: 2121814; Supplier Part Number 17: 1469719RL; Supplier Part Number 19: 70202660; Supplier Part Number 20: 70272767; Supplier Part Number 21: 42K3500; Supplier Part Number 22: 6128776; Supplier Part Number 24: CRCW040247K0FKED-REEL; Supplier Part Number 23: CRCW040247K0FKED-CUTT; Supplier Part Number 25: 24W2315; Supplier Part Number 26: 1688455; Supplier Part Number 27: 1823505
U4 = IC - TPL5111: Timers & Support Products Ultra Low Power System Timer (35 nA) for Power Gating in duty cycled applications.; Supply Voltage - Min: 1.8V; Supply Voltage - Max: 5.5V; Height: 1.1mm; ROHS: Yes; Minimum Operating Temperature: -40; Maximum Operating Temperature: +105; ComponentLink1Description: DataSheet; ComponentLink1URL: http://www.ti.com/general/docs/suppproductinfo.tsp?distId=26&gotoUrl=http%3A%2F%2Fwww.ti.com%2Flit%2Fgpn%2Ftpl5111; ComponentLink2Description: Mouser; ComponentLink2URL: https://www.mouser.com/Search/Refine.aspx?Keyword=595-TPL5111DDCT; Supplier 1: Mouser; Supplier 2: Arrow; Supplier 3: Farnell; Supplier 4: Digi-Key; Supplier 5: Newark; Supplier Part Number 1: 595-TPL5111DDCT; Supplier Part Number 2: TPL5111DDCT; Supplier Part Number 3: 3006922; Supplier Part Number 4: 296-42621-1-ND; Supplier Part Number 5: 28AH5709; Mouser Part Number: 595-TPL5111DDCT; Case: SOT-23-6
U5 = IC - TPS22917DBVR: Power Switch MosFet; Height: 1.45mm; ComponentLink1Description: DataSheet; ComponentLink1URL: http://www.ti.com/lit/gpn/tps22917; ComponentLink2Description: Mouser; ComponentLink2URL: https://www.mouser.com/Search/Refine.aspx?Keyword=595-TPS22917DBVR; Supplier 1: Mouser; Supplier 2: Digi-Key; Supplier Part Number 1: 595-TPS22917DBVR; Supplier Part Number 2: 296-50498-1-ND; Mouser Part Number: 595-TPS22917DBVR; Case: SOT-23-6

## Sheet FOTA Burn Buffer.SchDoc: FOTA Burn Buffer
size 292 x 193 mm; ApprovedBy: M. Günce Akkoyun; CheckedBy: M. Günce Akkoyun; Author: M. Günce Akkoyun; CompanyName: Ovoo Electronics; DrawnBy: M. Günce Akkoyun; Engineer: M. Günce Akkoyun; Organization: Ovoo Electronics; Address1: Necip Fazıl Mah. Ortaırmak Sok.; Address2: Birgül Apt. No: 19/6; Address3: Meram / Konya; Address4: Turkiye; DocumentNumber: 47; Revision: R01; SheetNumber: 33; SheetTotal: 44
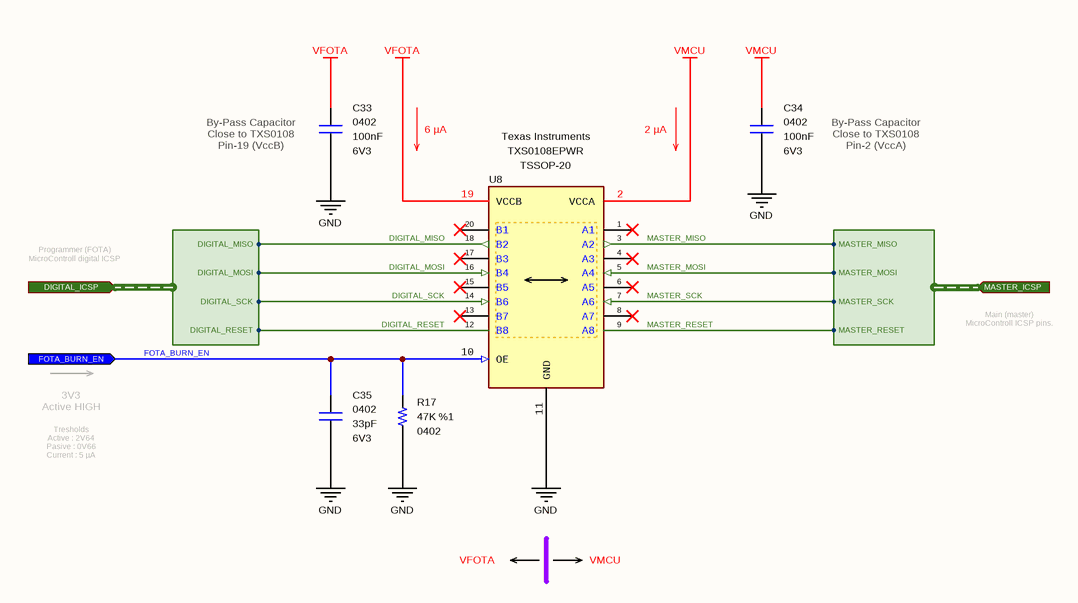
[diagram p36: FOTA Burn Buffer.SchDoc]

### Parts
C33  value 100nF  Case: 0402  Voltage: 6V3  [CAPACITOR_0402]  (hidden comment: Multilayer Ceramic Capacitor)
C34  value 100nF  Case: 0402  Voltage: 6V3  [CAPACITOR_0402]  (hidden comment: Multilayer Ceramic Capacitor)
C35  value 33pF  Case: 0402  Voltage: 6V3  [CAPACITOR_0402]  (hidden comment: Multilayer Ceramic Capacitor)
R17  value 47K  Tolerance: %1  Case: 0402  [RESISTOR_0402]  (hidden comment: 47K - 0402 - %1 - 1/16W)
U8  Manufacturer Part Number: TXS0108EPWR  Manufacturer Name: Texas Instruments  [TSSOP-20]  (hidden comment: Voltage Level Shifter)

### Ports
DIGITAL_ICSP (in, harness DIGITAL_ICSP), FOTA_BURN_EN (in), MASTER_ICSP (in, harness MASTER_ICSP)

### Harnesses
MASTER_ICSP: MASTER_MOSI, MASTER_MISO, MASTER_SCK, MASTER_RESET
DIGITAL_ICSP: DIGITAL_MOSI, DIGITAL_MISO, DIGITAL_SCK, DIGITAL_RESET

### Nets
GND: C33.1 C34.1 C35.2 R17.1 U8.11(GND)
VFOTA: C33.2 U8.19(VCCB)
VMCU: C34.2 U8.2(VCCA)
DIGITAL_MISO: U8.18(B2) ; port DIGITAL_ICSP.DIGITAL_MISO  [project net DIGITAL_ICSP.DIGITAL_MISO]
DIGITAL_MOSI: U8.16(B4) ; port DIGITAL_ICSP.DIGITAL_MOSI  [project net DIGITAL_ICSP.DIGITAL_MOSI]
DIGITAL_RESET: U8.12(B8) ; port DIGITAL_ICSP.DIGITAL_RESET  [project net DIGITAL_ICSP.DIGITAL_RESET]
DIGITAL_SCK: U8.14(B6) ; port DIGITAL_ICSP.DIGITAL_SCK  [project net DIGITAL_ICSP.DIGITAL_SCK]
FOTA_BURN_EN: C35.1 R17.2 U8.10(OE) ; port FOTA_BURN_EN
MASTER_MISO: U8.3(A2) ; port MASTER_ICSP.MASTER_MISO  [project net MASTER_ICSP.MASTER_MISO]
MASTER_MOSI: U8.5(A4) ; port MASTER_ICSP.MASTER_MOSI  [project net MASTER_ICSP.MASTER_MOSI]
MASTER_RESET: U8.9(A8) ; port MASTER_ICSP.MASTER_RESET  [project net MASTER_ICSP.MASTER_RESET]
MASTER_SCK: U8.7(A6) ; port MASTER_ICSP.MASTER_SCK  [project net MASTER_ICSP.MASTER_SCK]

Not connected (* = marked no-connect by the designer): U8 1(A1)* 4(A3)* 6(A5)* 8(A7)* 13(B7)* 15(B5)* 17(B3)* 20(B1)*

### Notes on the sheet
- (near C33) By-Pass Capacitor
  Close to TXS0108
  Pin-19 (VccB)
- 6 µA
- 2 µA
- By-Pass Capacitor
  Close to TXS0108
  Pin-2 (VccA)
- Programmer (FOTA) MicroControll digital ICSP pins.
- Main (master) MicroControll ICSP pins.
- 3V3
  Active HIGH
- Tresholds
  Active : 2V64
  Pasive : 0V66
  Current : 5 µA
- VFOTA
- VMCU
- © 2021 All rights reserved.
  This document may not, in whole or in part, be copied, photocopied, reproduced, translated or converted to any electronic or machine readable from without prior written permission of Mehmet Günce Akkoyun.
  Engineer contact : akkoyun@me.com
- Property of
- Engineer :
- Date :
- Size :
- A4
- Time :
- Project :
- Page :
- /
- Customer :
- Product ID :
- Module ID :
- Version :
- File :
- Revision :

### Library data of the parts
C33 C34 = Capacitor - 100nF [0402-6V3]: as C20 on sheet FOTA MicroController Power Switch; Height: 0.25mm; ComponentLink1Description: Mouser; ComponentLink1URL: https://www.mouser.com.tr/ProductDetail/AVX/04026D104KAT4A?qs=sGAEpiMZZMs0AnBnWHyRQPg4iYkCw7IMED%2F4kpqgf7w%3D; ComponentLink2Description: DataSheet; ComponentLink2URL: https://www.mouser.com.tr/datasheet/2/40/cx5r-776519.pdf; ROHS: Yes; Maximum Operating Temperature: +85; Minimum Operating Temperature: -55; Supplier 1: Avnet; Supplier Part Number 1: 04026D104KAT4A; Mouser Part Number: 581-04026D104KAT4A
C35 = Capacitor - 33pF [0402-6V3]: as C22 on sheet FOTA MicroController Power Switch; Height: 0.5mm; Maximum Operating Temperature: +125; Minimum Operating Temperature: -55; ROHS: Yes; ComponentLink1Description: DataSheet; ComponentLink1URL: https://api.kemet.com/component-edge/download/datasheet/C0402C330J9RACAUTO.pdf; ComponentLink2Description: Mouser; ComponentLink2URL: https://www.mouser.com/Search/Refine.aspx?Keyword=80-C0402C330J9RAUTO; Supplier 1: Mouser; Supplier Part Number 1: 80-C0402C330J9RAUTO; Mouser Part Number: 80-C0402C330J9RAUTO
R17 = Resistor - 47K: as R9 on sheet FOTA MicroController Power Switch; Height: 0.4mm; ComponentLink1Description: DataSheet; ComponentLink1URL: https://www.mouser.com.tr/datasheet/2/427/dcrcwe3-1762152.pdf; ComponentLink2Description: Mouser; ComponentLink2URL: https://www.mouser.com.tr/ProductDetail/Vishay-Dale/CRCW040247K0FKED?qs=sGAEpiMZZMu61qfTUdNhG2DpbjADlD3GL%252B3h1elTxqU%3D; Supplier 1: RSComponents; Supplier 2: Newark; Supplier Part Number 1: 6789361P; Supplier Part Number 2: 52K7097; Supplier 3: Avnet; Supplier 4: RSComponents; Supplier 5: Future Electronics; Supplier 6: Future Electronics; Supplier 7: Newark; Supplier 8: Arrow Electronics; Supplier 9: Mouser; Supplier 10: Newark; Supplier 11: Avnet; Supplier 12: Digi-Key; Supplier 13: Digi-Key; Supplier 14: Digi-Key; Supplier 15: Newark; Supplier 16: Farnell; Supplier 17: Farnell; Supplier 18: Farnell; Supplier 19: Allied Electronics; Supplier 20: Allied Electronics; Supplier 21: Avnet; Supplier 22: Future Electronics; Supplier 23: Future Electronics; Supplier 24: Future Electronics; Supplier 25: Newark; Supplier 26: RSComponents; Supplier 27: RSComponents; Supplier Part Number 3: 52K7097; Supplier Part Number 4: 6789361; Supplier Part Number 5: 2103738; Supplier Part Number 6: 7521222; Supplier Part Number 7: 42K3500; Supplier Part Number 8: CRCW040247K0FKED; Supplier Part Number 12: 541-47.0KLCT-ND; Supplier Part Number 14: 541-47.0KLTR-ND; Supplier Part Number 10: 61M5310; Supplier Part Number 9: 71-CRCW0402-47K-E3; Supplier Part Number 13: 541-47.0KLDKR-ND; Supplier Part Number 11: CRCW040247K0FKED; Supplier Part Number 15: 25AC7165; Supplier Part Number 16: 1469719; Supplier Part Number 18: 2121814; Supplier Part Number 17: 1469719RL; Supplier Part Number 19: 70202660; Supplier Part Number 20: 70272767; Supplier Part Number 21: 42K3500; Supplier Part Number 22: 6128776; Supplier Part Number 24: CRCW040247K0FKED-REEL; Supplier Part Number 23: CRCW040247K0FKED-CUTT; Supplier Part Number 25: 24W2315; Supplier Part Number 26: 1688455; Supplier Part Number 27: 1823505
U8 = IC - TXS0108EPW: Translation - Voltage Levels 8B Bidir Vltg-Level Translator; Supply Voltage - Max: 5.5V; Supply Voltage - Min: 1.2V; Height: 1.2mm; Mouser Part Number: 595-TXS0108EPWR; ComponentLink1Description: DataSheet; ComponentLink1URL: https://www.ti.com/lit/ds/symlink/txs0108e.pdf?HQS=dis-mous-null-mousermode-dsf-pf-null-wwe&ts=1609232216318&ref_url=https%253A%252F%252Fwww.mouser.com.tr%252F; Maximum Operating Temperature: +85; Minimum Operating Temperature: -40; ComponentLink2Description: Mouser; ComponentLink2URL: https://www.mouser.com.tr/ProductDetail/Texas-Instruments/TXS0108EPWR/?qs=IUbkBnfnSQLgiWtCbWtYOw%3D%3D; Supplier 2: Mouser; Supplier 3: Digi-Key; Supplier 4: Digi-Key; Supplier 5: Digi-Key; Supplier 6: Farnell; Supplier 7: Farnell; Supplier 8: Farnell; Supplier 9: RSComponents; Supplier 10: RSComponents; Supplier 1: Arrow Electronics; Supplier Part Number 1: TXS0108EPWR; Supplier Part Number 2: 595-TXS0108EPWR; Supplier Part Number 3: 296-23011-1-ND; Supplier Part Number 4: 296-23011-6-ND; Supplier Part Number 5: 296-23011-2-ND; Supplier Part Number 6: 1702548; Supplier Part Number 7: 1702548RL; Supplier Part Number 8: 2437921; Supplier Part Number 9: 7094639P; Supplier Part Number 10: 7094639; Case: TSSOP-20

## Sheet I2C Network.SchDoc: I2C Network Block Diagram
size 292 x 193 mm; ApprovedBy: M. Günce Akkoyun; CheckedBy: M. Günce Akkoyun; Author: M. Günce Akkoyun; CompanyName: Ovoo Electronics; DrawnBy: M. Günce Akkoyun; Engineer: M. Günce Akkoyun; Organization: Ovoo Electronics; Address1: Necip Fazıl Mah. Ortaırmak Sok.; Address2: Birgül Apt. No: 19/6; Address3: Meram / Konya; Address4: Turkiye; DocumentNumber: 49; Revision: R01; SheetNumber: 38; SheetTotal: 44
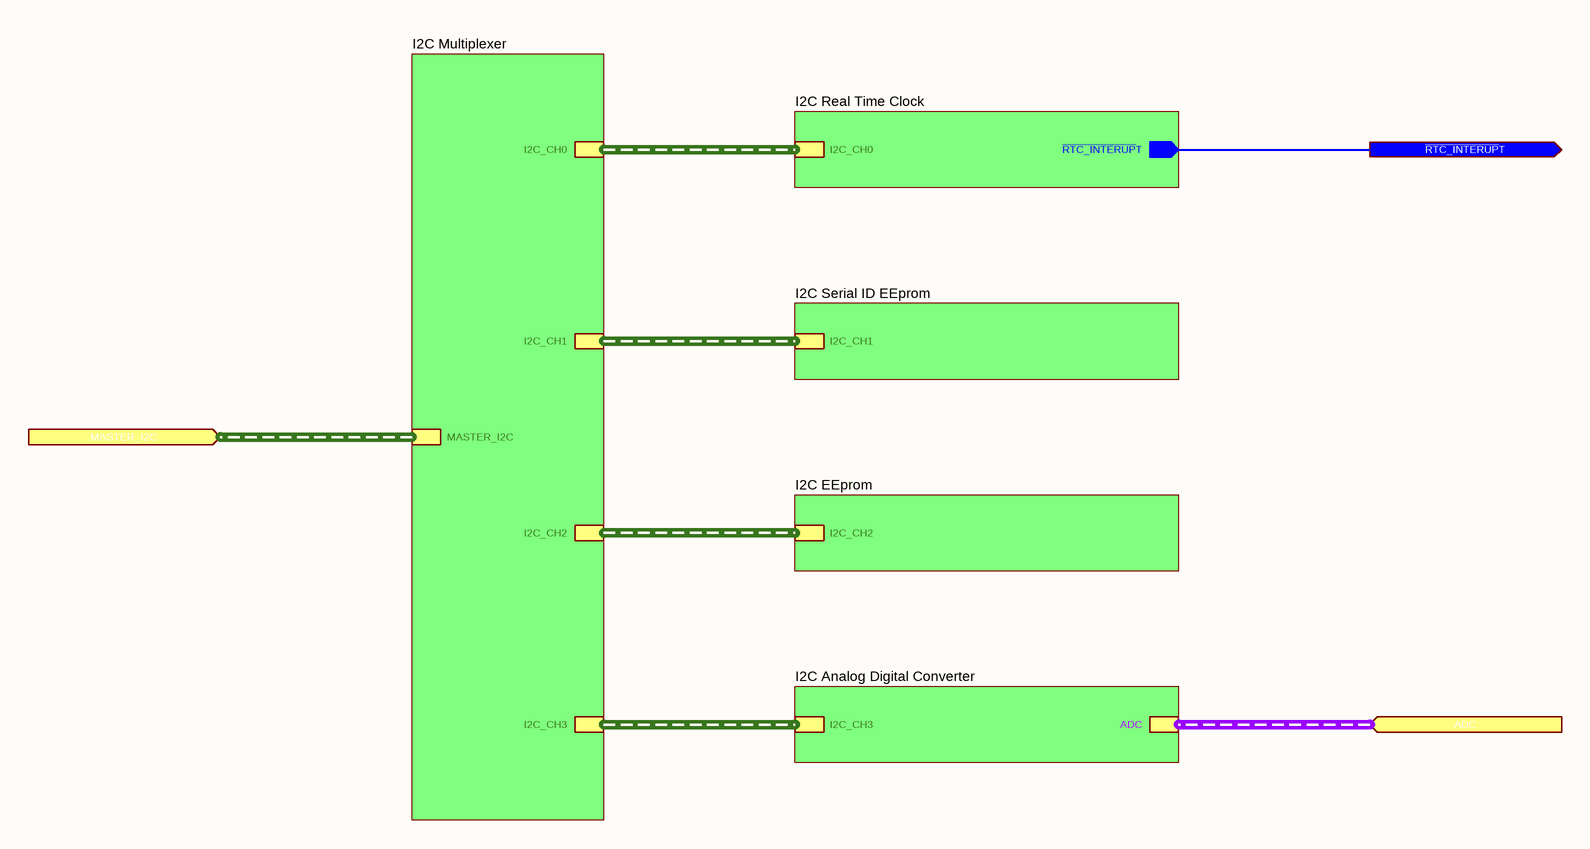
[diagram p37: I2C Network.SchDoc]

### Sub-sheets
I2C Analog Digital Converter = Analog Digital Converter.SchDoc: I2C_CH3 (harness I2C_CH3), ADC (harness ADC)
I2C EEprom = EEPROM.SchDoc: I2C_CH2 (harness I2C_CH2)
I2C Multiplexer = I2C Multiplexer.SchDoc: I2C_CH1 (harness I2C_CH1), I2C_CH2 (harness I2C_CH2), I2C_CH3 (harness I2C_CH3), I2C_CH0 (harness I2C_CH0), MASTER_I2C (harness MASTER_I2C)
I2C Real Time Clock = Real Time Clock.SchDoc: ~{RTC_INTERUP}T (out), I2C_CH0 (harness I2C_CH0)
I2C Serial ID EEprom = Serial ID EEPROM.SchDoc: I2C_CH1 (harness I2C_CH1)

### Ports
ADC (in, harness ADC), MASTER_I2C (in, harness MASTER_I2C), ~{RTC_INTERUP}T (out)

### Nets
~{RTC_INTERUP}T: port ~{RTC_INTERUP}T, sheet I2C Real Time Clock/~{RTC_INTERUP}T

### Buses and harness runs
harness port ADC = sheet I2C Analog Digital Converter/ADC
harness port MASTER_I2C = sheet I2C Multiplexer/MASTER_I2C
harness sheet I2C Analog Digital Converter/I2C_CH3 = sheet I2C Multiplexer/I2C_CH3
harness sheet I2C EEprom/I2C_CH2 = sheet I2C Multiplexer/I2C_CH2
harness sheet I2C Multiplexer/I2C_CH0 = sheet I2C Real Time Clock/I2C_CH0
harness sheet I2C Multiplexer/I2C_CH1 = sheet I2C Serial ID EEprom/I2C_CH1

### Notes on the sheet
- © 2021 All rights reserved.
  This document may not, in whole or in part, be copied, photocopied, reproduced, translated or converted to any electronic or machine readable from without prior written permission of Mehmet Günce Akkoyun.
  Engineer contact : akkoyun@me.com
- Property of
- Engineer :
- Date :
- Size :
- A4
- Time :
- Project :
- Page :
- /
- Customer :
- Product ID :
- Module ID :
- Version :
- File :
- Revision :

## Sheet I2C Multiplexer.SchDoc: I2C Multiplexer
size 292 x 193 mm; ApprovedBy: M. Günce Akkoyun; CheckedBy: M. Günce Akkoyun; Author: M. Günce Akkoyun; CompanyName: Ovoo Electronics; DrawnBy: M. Günce Akkoyun; Engineer: M. Günce Akkoyun; Organization: Ovoo Electronics; Address1: Necip Fazıl Mah. Ortaırmak Sok.; Address2: Birgül Apt. No: 19/6; Address3: Meram / Konya; Address4: Turkiye; DocumentNumber: 50; Revision: R01; SheetNumber: 39; SheetTotal: 44
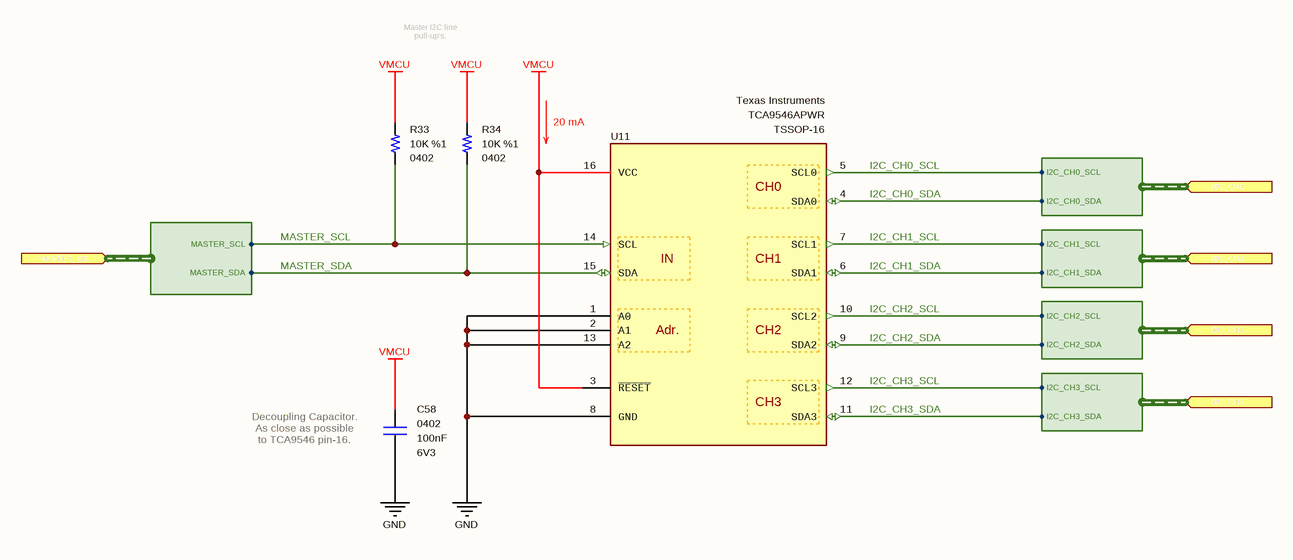
[diagram p38: I2C Multiplexer.SchDoc]

### Parts
C58  value 100nF  Case: 0402  Voltage: 6V3  [CAPACITOR_0402]  (hidden comment: Multilayer Ceramic Capacitor)
R33  value 10K  Tolerance: %1  Case: 0402  [RESISTOR_0402]  (hidden comment: Thick Film Resistor)
R34  value 10K  Tolerance: %1  Case: 0402  [RESISTOR_0402]  (hidden comment: Thick Film Resistor)
U11  Manufacturer Part Number: TCA9546APWR  Manufacturer Name: Texas Instruments  [TSSOP-16]  (hidden comment: I2C Switch IC)

### Ports
I2C_CH0 (in, harness I2C_CH0), I2C_CH1 (in, harness I2C_CH1), I2C_CH2 (in, harness I2C_CH2), I2C_CH3 (in, harness I2C_CH3), MASTER_I2C (in, harness MASTER_I2C)

### Harnesses
MASTER_I2C: MASTER_SDA, MASTER_SCL
I2C_CH0: I2C_CH0_SCL, I2C_CH0_SDA
I2C_CH1: I2C_CH1_SCL, I2C_CH1_SDA
I2C_CH2: I2C_CH2_SCL, I2C_CH2_SDA
I2C_CH3: I2C_CH3_SCL, I2C_CH3_SDA

### Nets
GND: C58.1 U11.1(A0) U11.2(A1) U11.8(GND) U11.13(A2)
VMCU: C58.2 R33.2 R34.2 U11.3(~{RESET}) U11.16(VCC)
I2C_CH0_SCL: U11.5(SCL0) ; port I2C_CH0.I2C_CH0_SCL
I2C_CH0_SDA: U11.4(SDA0) ; port I2C_CH0.I2C_CH0_SDA
I2C_CH1_SCL: U11.7(SCL1) ; port I2C_CH1.I2C_CH1_SCL
I2C_CH1_SDA: U11.6(SDA1) ; port I2C_CH1.I2C_CH1_SDA
I2C_CH2_SCL: U11.10(SCL2) ; port I2C_CH2.I2C_CH2_SCL
I2C_CH2_SDA: U11.9(SDA2) ; port I2C_CH2.I2C_CH2_SDA
I2C_CH3_SCL: U11.12(SCL3) ; port I2C_CH3.I2C_CH3_SCL
I2C_CH3_SDA: U11.11(SDA3) ; port I2C_CH3.I2C_CH3_SDA
MASTER_SCL: R33.1 U11.14(SCL) ; port MASTER_I2C.MASTER_SCL  [project net MASTER_I2C.MASTER_SCL]
MASTER_SDA: R34.1 U11.15(SDA) ; port MASTER_I2C.MASTER_SDA  [project net MASTER_I2C.MASTER_SDA]

### Notes on the sheet
- Master I2C line pull-up's.
- (near U11) 20 mA
- (near C58) Decoupling Capacitor. As close as possible to TCA9546 pin-16.
- © 2021 All rights reserved.
  This document may not, in whole or in part, be copied, photocopied, reproduced, translated or converted to any electronic or machine readable from without prior written permission of Mehmet Günce Akkoyun.
  Engineer contact : akkoyun@me.com
- Property of
- Engineer :
- Date :
- Size :
- A4
- Time :
- Project :
- Page :
- /
- Customer :
- Product ID :
- Module ID :
- Version :
- File :
- Revision :
- (in symbol IC - TCA9546APWR) CH0; IN; CH1; Adr.; CH2; CH3

### Library data of the parts
C58 = Capacitor - 100nF [0402-6V3]: as C20 on sheet FOTA MicroController Power Switch; Height: 0.25mm; ComponentLink1Description: Mouser; ComponentLink1URL: https://www.mouser.com.tr/ProductDetail/AVX/04026D104KAT4A?qs=sGAEpiMZZMs0AnBnWHyRQPg4iYkCw7IMED%2F4kpqgf7w%3D; ComponentLink2Description: DataSheet; ComponentLink2URL: https://www.mouser.com.tr/datasheet/2/40/cx5r-776519.pdf; ROHS: Yes; Maximum Operating Temperature: +85; Minimum Operating Temperature: -55; Supplier 1: Avnet; Supplier Part Number 1: 04026D104KAT4A; Mouser Part Number: 581-04026D104KAT4A
R33 R34 = Resistor - 10K: Thick Film Resistors - SMD 1/16 W 10 Kohms 1%; Manufacturer Name: Vishay; Manufacturer Part Number: CRCW040210K0FKED; Height: 0.4mm; ComponentLink1Description: DataSheet; ComponentLink1URL: https://www.mouser.com.tr/datasheet/2/427/dcrcwe3-1762152.pdf; ComponentLink2Description: Mouser; ComponentLink2URL: https://www.mouser.com.tr/ProductDetail/Vishay-Dale/CRCW040210K0FKED?qs=sGAEpiMZZMu61qfTUdNhG2DpbjADlD3GcalbOv9utCY%3D; Supplier 1: Mouser; Supplier 2: Digi-Key; Supplier Part Number 1: 71-CRCW040210K0FKEDH; Supplier Part Number 2: 541-10.0KYCT-ND; Mouser Part Number: 71-CRCW0402-10K-E3
U11 = IC - TCA9546APWR: Switch ICs - Various 4-Channel I2C and SMBus; Mouser Part Number: 595-TCA9546APWR; ComponentLink1Description: DataSheet; ComponentLink1URL: http://www.ti.com/lit/ds/symlink/tca9546a.pdf; ComponentLink2Description: Mouser; ComponentLink2URL: https://eu.mouser.com/ProductDetail/Texas-Instruments/TCA9546APWR?qs=sGAEpiMZZMu0f%252BT2bkVfuqY85%252BzcFu6eZaMCXRqwDMg%3D; Minimum Operating Temperature: -40; Maximum Operating Temperature: +85; Supplier 1: Mouser; Supplier 2: Farnell; Supplier 3: Newark; Supplier 4: Digi-Key; Supplier Part Number 1: 595-TCA9546APWR; Supplier Part Number 2: 3006768; Supplier Part Number 3: 28AH5268; Supplier Part Number 4: 296-40578-1-ND; Case: TSSOP-16